# EasyEDA schematic SH_input_2.json
TITLE: Sheet_1; REV: 1.0; Date: 2020-05-24; Sheet: 1/1; Company: Your Company
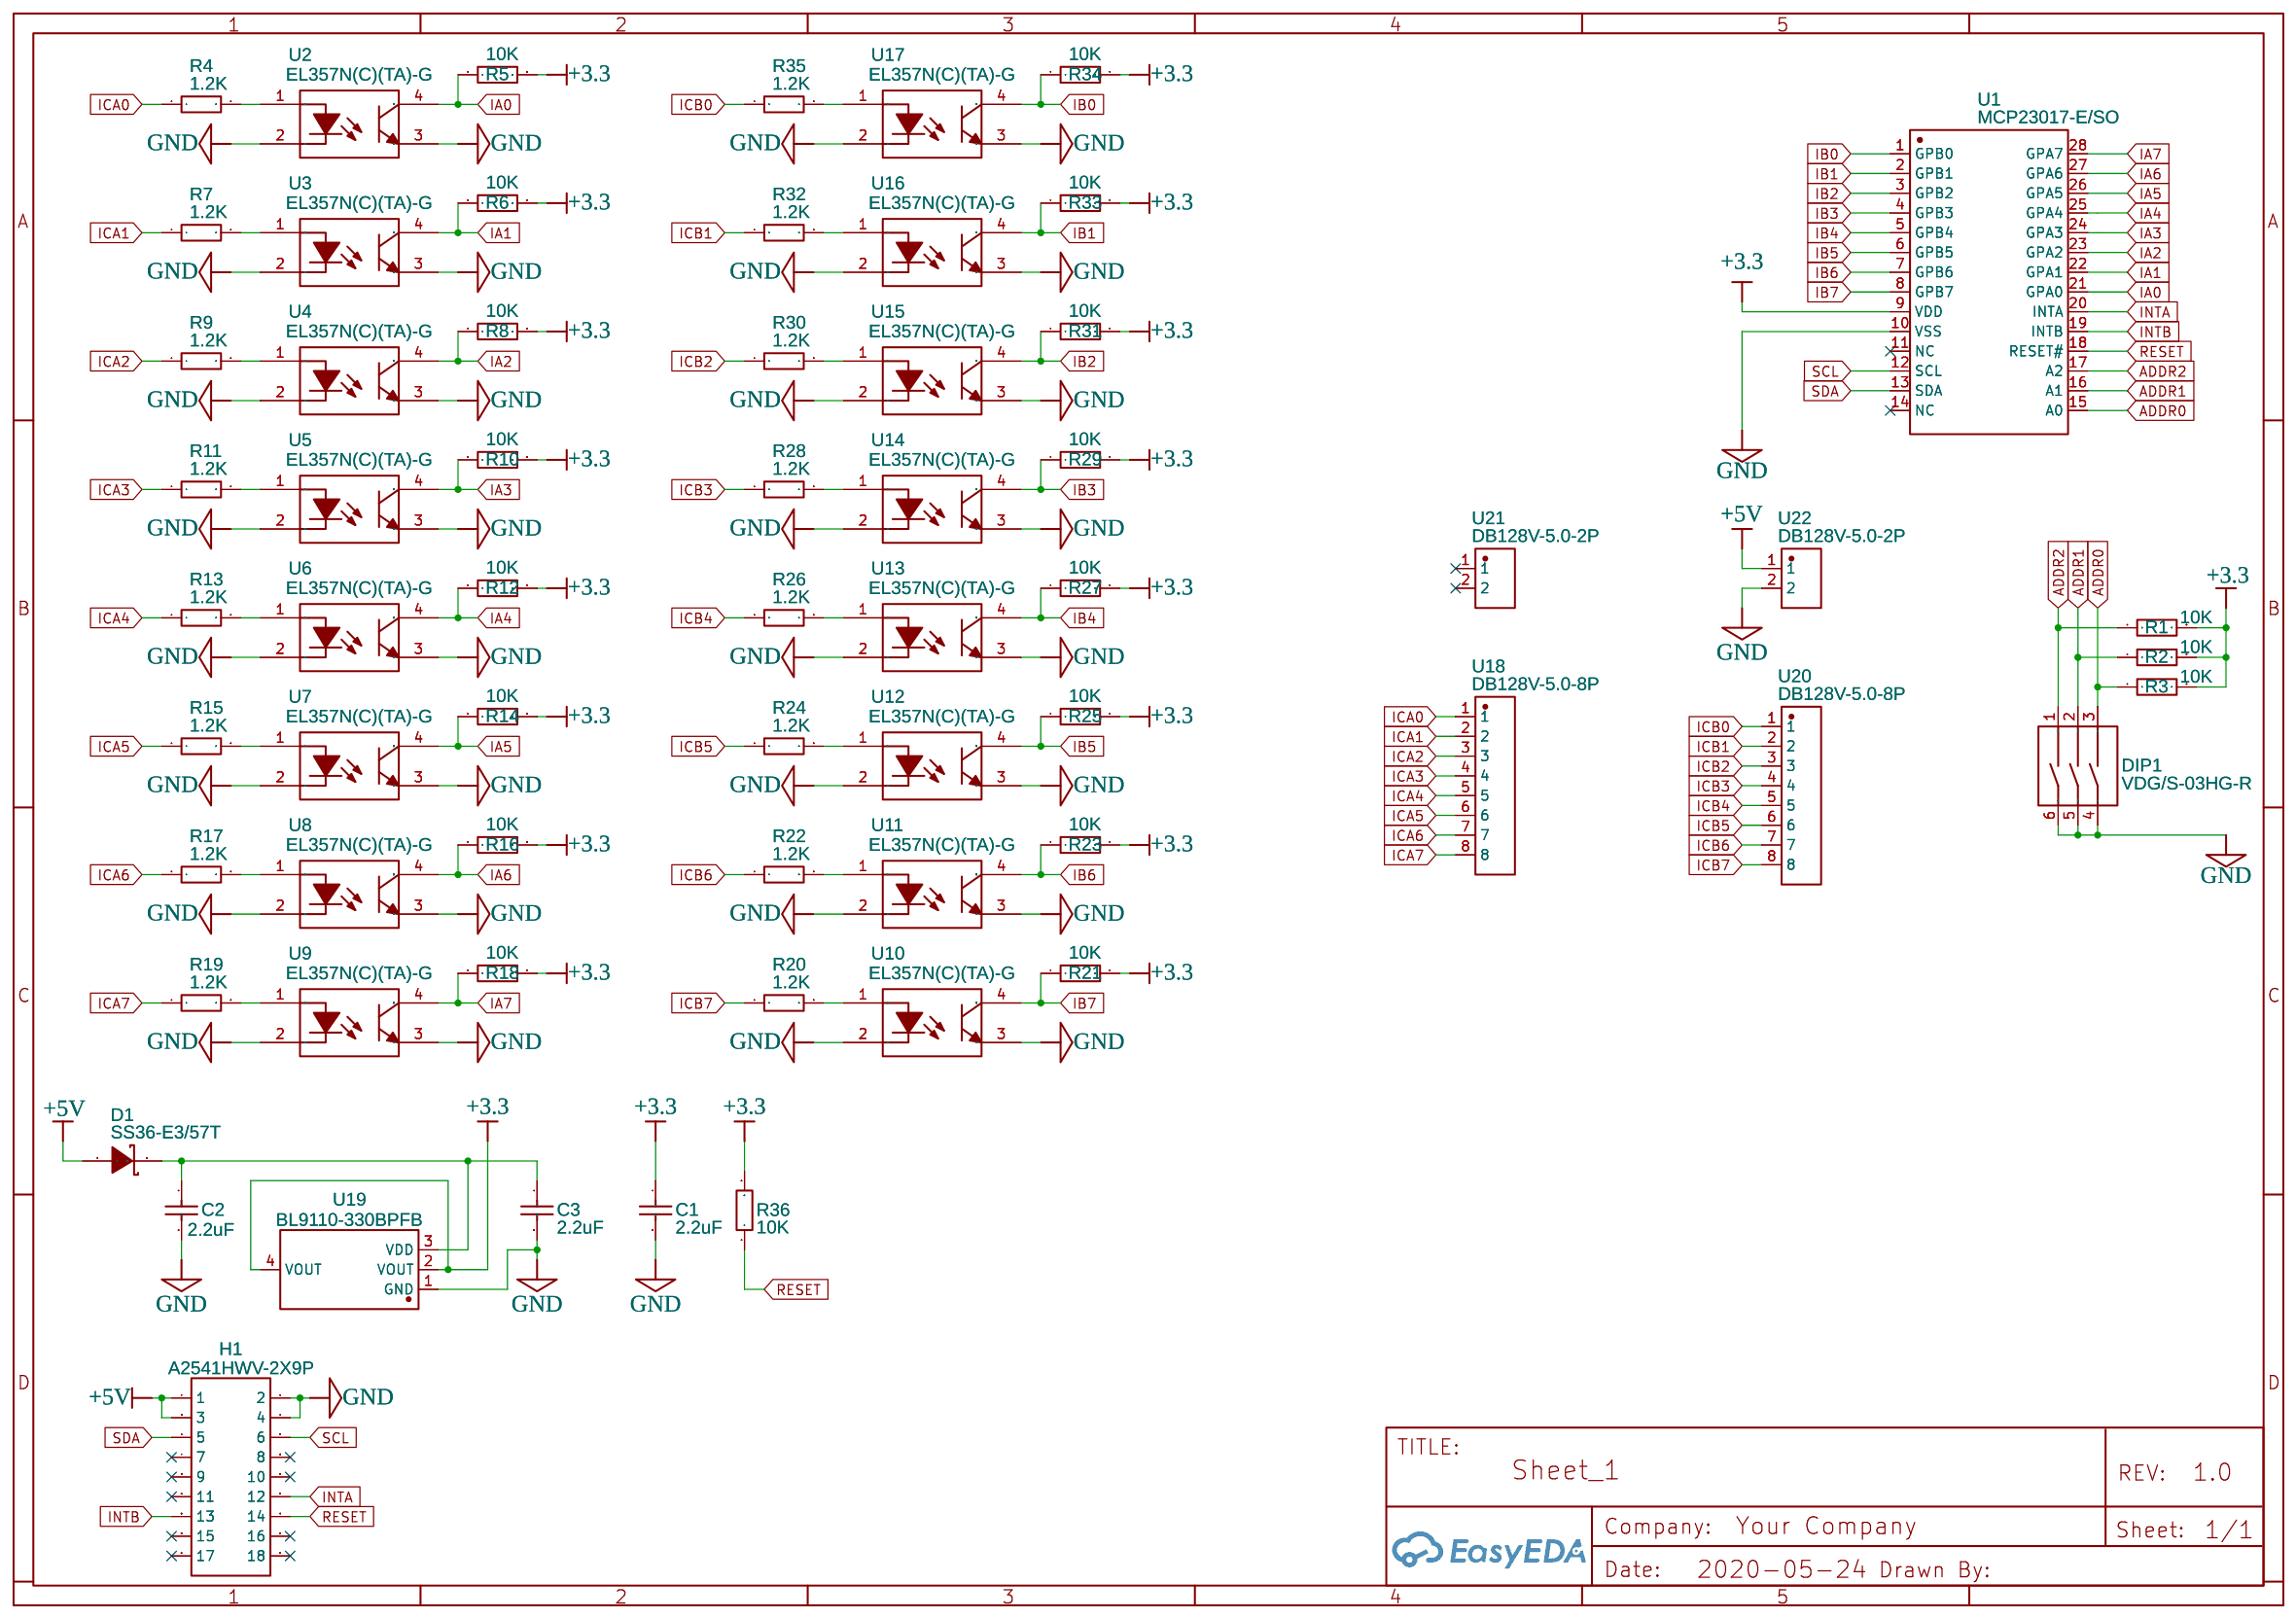
[diagram p0: schematic sheet]

## Parts
C1  2.2uF  [C1206]
C2  2.2uF  [C1206]
C3  2.2uF  [C1206]
D1  SS36-E3/57T  [SMC_L7.1-W6.2-LS8.1-FD]
DIP1  VDG/S-03HG-R  [SW-TH_VDG-03HG-R]
H1  A2541HWV-2X9P  [HDR-TH_18P-P2.54-V-R2-C9-S2.54]
R1  10K  [R0603]
R2  10K  [R0603]
R3  10K  [R0603]
R4  1.2K  [R0603]
R5  10K  [R0603]
R6  10K  [R0603]
R7  1.2K  [R0603]
R8  10K  [R0603]
R9  1.2K  [R0603]
R10  10K  [R0603]
R11  1.2K  [R0603]
R12  10K  [R0603]
R13  1.2K  [R0603]
R14  10K  [R0603]
R15  1.2K  [R0603]
R16  10K  [R0603]
R17  1.2K  [R0603]
R18  10K  [R0603]
R19  1.2K  [R0603]
R20  1.2K  [R0603]
R21  10K  [R0603]
R22  1.2K  [R0603]
R23  10K  [R0603]
R24  1.2K  [R0603]
R25  10K  [R0603]
R26  1.2K  [R0603]
R27  10K  [R0603]
R28  1.2K  [R0603]
R29  10K  [R0603]
R30  1.2K  [R0603]
R31  10K  [R0603]
R32  1.2K  [R0603]
R33  10K  [R0603]
R34  10K  [R0603]
R35  1.2K  [R0603]
R36  10K  [R0603]
U1  MCP23017-E/SO  [SOIC-28_L18.1-W10.3-P1.27-LS10.3-BL]
U2  EL357N(C)(TA)-G  [SOP-4_L3.9-W4.4-P2.54-LS7.0-TL]
U3  EL357N(C)(TA)-G  [SOP-4_L3.9-W4.4-P2.54-LS7.0-TL]
U4  EL357N(C)(TA)-G  [SOP-4_L3.9-W4.4-P2.54-LS7.0-TL]
U5  EL357N(C)(TA)-G  [SOP-4_L3.9-W4.4-P2.54-LS7.0-TL]
U6  EL357N(C)(TA)-G  [SOP-4_L3.9-W4.4-P2.54-LS7.0-TL]
U7  EL357N(C)(TA)-G  [SOP-4_L3.9-W4.4-P2.54-LS7.0-TL]
U8  EL357N(C)(TA)-G  [SOP-4_L3.9-W4.4-P2.54-LS7.0-TL]
U9  EL357N(C)(TA)-G  [SOP-4_L3.9-W4.4-P2.54-LS7.0-TL]
U10  EL357N(C)(TA)-G  [SOP-4_L3.9-W4.4-P2.54-LS7.0-TL]
U11  EL357N(C)(TA)-G  [SOP-4_L3.9-W4.4-P2.54-LS7.0-TL]
U12  EL357N(C)(TA)-G  [SOP-4_L3.9-W4.4-P2.54-LS7.0-TL]
U13  EL357N(C)(TA)-G  [SOP-4_L3.9-W4.4-P2.54-LS7.0-TL]
U14  EL357N(C)(TA)-G  [SOP-4_L3.9-W4.4-P2.54-LS7.0-TL]
U15  EL357N(C)(TA)-G  [SOP-4_L3.9-W4.4-P2.54-LS7.0-TL]
U16  EL357N(C)(TA)-G  [SOP-4_L3.9-W4.4-P2.54-LS7.0-TL]
U17  EL357N(C)(TA)-G  [SOP-4_L3.9-W4.4-P2.54-LS7.0-TL]
U18  DB128V-5.0-8P  [CONN-TH_8P-P5.00_DB128V-5.0-8P]
U19  BL9110-330BPFB  [SOT-223_L6.5-W3.5-P2.30-LS7.0-BR]
U20  DB128V-5.0-8P  [CONN-TH_8P-P5.00_DB128V-5.0-8P]
U21  DB128V-5.0-2P  [CONN-TH_2P-P5.00_DB128V-5.0-2P]
U22  DB128V-5.0-2P  [CONN-TH_2P-P5.00_DB128V-5.0-2P]

## Library data of the parts
C1-C3 = CL31B225KBHNNNE: Supplier: LCSC; Manufacturer: SAMSUNG; LCSC Assembly: Yes; Supplier Part: C50254; SMT Type: Basic
D1 = SS36-E3/57T: Supplier: LCSC; LCSC Assembly: Yes; Manufacturer: VISHAY; image: //image.lceda.cn/szlcsc/C35722.jpg; Supplier Part: C35722; SMT Type: Basic
DIP1 = VDG/S-03HG-R: Supplier: LCSC; Manufacturer: ReliaPro; image: //image.lceda.cn/szlcsc/C52648.jpg; Supplier Part: C52648
H1 = A2541HWV-2X9P: Supplier: LCSC; Supplier Part: C239349; Manufacturer: Changjiang Connectors; Manufacturer Part: A2541HWV-2x9P; Contributor: LCSC; link: https://item.szlcsc.com/238453.html?ref=editor&logined=true
R1-R3 R5 R6 R8 R10 R12 R14 R16 R18 R21 R23 R25 R27 R29 R31 R33 R34 R36 = 0603WAF1002T5E: Supplier: LCSC; Manufacturer: UniOhm; LCSC Assembly: Yes; Supplier Part: C25804; SMT Type: Basic
R4 R7 R9 R11 R13 R15 R17 R19 R20 R22 R24 R26 R28 R30 R32 R35 = 0603WAF1201T5E: Supplier: LCSC; Manufacturer: UniOhm; LCSC Assembly: Yes; Supplier Part: C22765; SMT Type: Basic
U1 = MCP23017-E/SO: Supplier: LCSC; Manufacturer: MICROCHIP; image: //image.lceda.cn/szlcsc/C47023.jpg; Contributor: LCSC; Supplier Part: C47023; LCSC Assembly: Yes; SMT Type: Extend
U2-U17 = EL357N(C)(TA)-G: Supplier: LCSC; Manufacturer: EVERLIGHT; image: //image.lceda.cn/szlcsc/C29981.jpg; Supplier Part: C29981; LCSC Assembly: Yes; SMT Type: Basic
U18 U20 = DB128V-5.0-8P: Supplier: LCSC; Supplier Part: C395863; Manufacturer: DIBO; Contributor: LCSC
U19 = BL9110-330BPFB: Supplier: LCSC; Manufacturer: BL; Contributor: LCSC; Supplier Part: C169246; LCSC Assembly: Yes; SMT Type: Extend
U21 U22 = DB128V-5.0-2P: Supplier: LCSC; Supplier Part: C395860; Manufacturer: DIBO; Contributor: LCSC

## Nets
+5V: D1.1(A) H1.1 H1.3 U22.1
GND: C1.2 C2.2 C3.2 DIP1.4 DIP1.5 DIP1.6 H1.2 H1.4 U1.10(VSS) U2.2(CAT) U2.3(EM) U3.2(CAT) U3.3(EM) U4.2(CAT) U4.3(EM) U5.2(CAT) U5.3(EM) U6.2(CAT) U6.3(EM) U7.2(CAT) U7.3(EM) U8.2(CAT) U8.3(EM) U9.2(CAT) U9.3(EM) U10.2(CAT) U10.3(EM) U11.2(CAT) U11.3(EM) U12.2(CAT) U12.3(EM) U13.2(CAT) U13.3(EM) U14.2(CAT) U14.3(EM) U15.2(CAT) U15.3(EM) U16.2(CAT) U16.3(EM) U17.2(CAT) U17.3(EM) U19.1(GND) U22.2
+3.3: C1.1 R1.2 R2.2 R3.2 R5.2 R6.2 R8.2 R10.2 R12.2 R14.2 R16.2 R18.2 R21.2 R23.2 R25.2 R27.2 R29.2 R31.2 R33.2 R34.2 R36.2 U1.9(VDD) U19.2(VOUT) U19.4(VOUT)
ADDR0: DIP1.3 R3.1 U1.15(A0)
ADDR1: DIP1.2 R2.1 U1.16(A1)
ADDR2: DIP1.1 R1.1 U1.17(A2)
IA0: R5.1 U1.21(GPA0) U2.4(COL)
IA1: R6.1 U1.22(GPA1) U3.4(COL)
IA2: R8.1 U1.23(GPA2) U4.4(COL)
IA3: R10.1 U1.24(GPA3) U5.4(COL)
IA4: R12.1 U1.25(GPA4) U6.4(COL)
IA5: R14.1 U1.26(GPA5) U7.4(COL)
IA6: R16.1 U1.27(GPA6) U8.4(COL)
IA7: R18.1 U1.28(GPA7) U9.4(COL)
IB0: R34.1 U1.1(GPB0) U17.4(COL)
IB1: R33.1 U1.2(GPB1) U16.4(COL)
IB2: R31.1 U1.3(GPB2) U15.4(COL)
IB3: R29.1 U1.4(GPB3) U14.4(COL)
IB4: R27.1 U1.5(GPB4) U13.4(COL)
IB5: R25.1 U1.6(GPB5) U12.4(COL)
IB6: R23.1 U1.7(GPB6) U11.4(COL)
IB7: R21.1 U1.8(GPB7) U10.4(COL)
ICA0: R4.1 U18.1
ICA1: R7.1 U18.2
ICA2: R9.1 U18.3
ICA3: R11.1 U18.4
ICA4: R13.1 U18.5
ICA5: R15.1 U18.6
ICA6: R17.1 U18.7
ICA7: R19.1 U18.8
ICB0: R35.1 U20.1
ICB1: R32.1 U20.2
ICB2: R30.1 U20.3
ICB3: R28.1 U20.4
ICB4: R26.1 U20.5
ICB5: R24.1 U20.6
ICB6: R22.1 U20.7
ICB7: R20.1 U20.8
INTA: H1.12 U1.20(INTA)
INTB: H1.13 U1.19(INTB)
RESET: H1.14 R36.1 U1.18(RESET#)
SCL: H1.6 U1.12(SCL)
SDA: H1.5 U1.13(SDA)
Net-(C2-1): C2.1 C3.1 D1.2(K) U19.3(VDD)
Net-(R4-2): R4.2 U2.1(AN)
Net-(R7-2): R7.2 U3.1(AN)
Net-(R9-2): R9.2 U4.1(AN)
Net-(R11-2): R11.2 U5.1(AN)
Net-(R13-2): R13.2 U6.1(AN)
Net-(R15-2): R15.2 U7.1(AN)
Net-(R17-2): R17.2 U8.1(AN)
Net-(R19-2): R19.2 U9.1(AN)
Net-(R20-2): R20.2 U10.1(AN)
Net-(R22-2): R22.2 U11.1(AN)
Net-(R24-2): R24.2 U12.1(AN)
Net-(R26-2): R26.2 U13.1(AN)
Net-(R28-2): R28.2 U14.1(AN)
Net-(R30-2): R30.2 U15.1(AN)
Net-(R32-2): R32.2 U16.1(AN)
Net-(R35-2): R35.2 U17.1(AN)

Not connected (* = marked no-connect by the designer): H1 7* 8* 9* 10* 11* 15* 16* 17* 18*; U1 11(NC)* 14(NC)*; U21 1* 2*
